# Altium schematic sheet Raspi_side.SchDoc
size A4; Organization: Altium Limited; Address1: L3, 12a Rodborough Rd; Address2: Frenchs Forest; Address3: NSW; Address4: Australia 2086; SheetNumber: 3; SheetTotal: 3
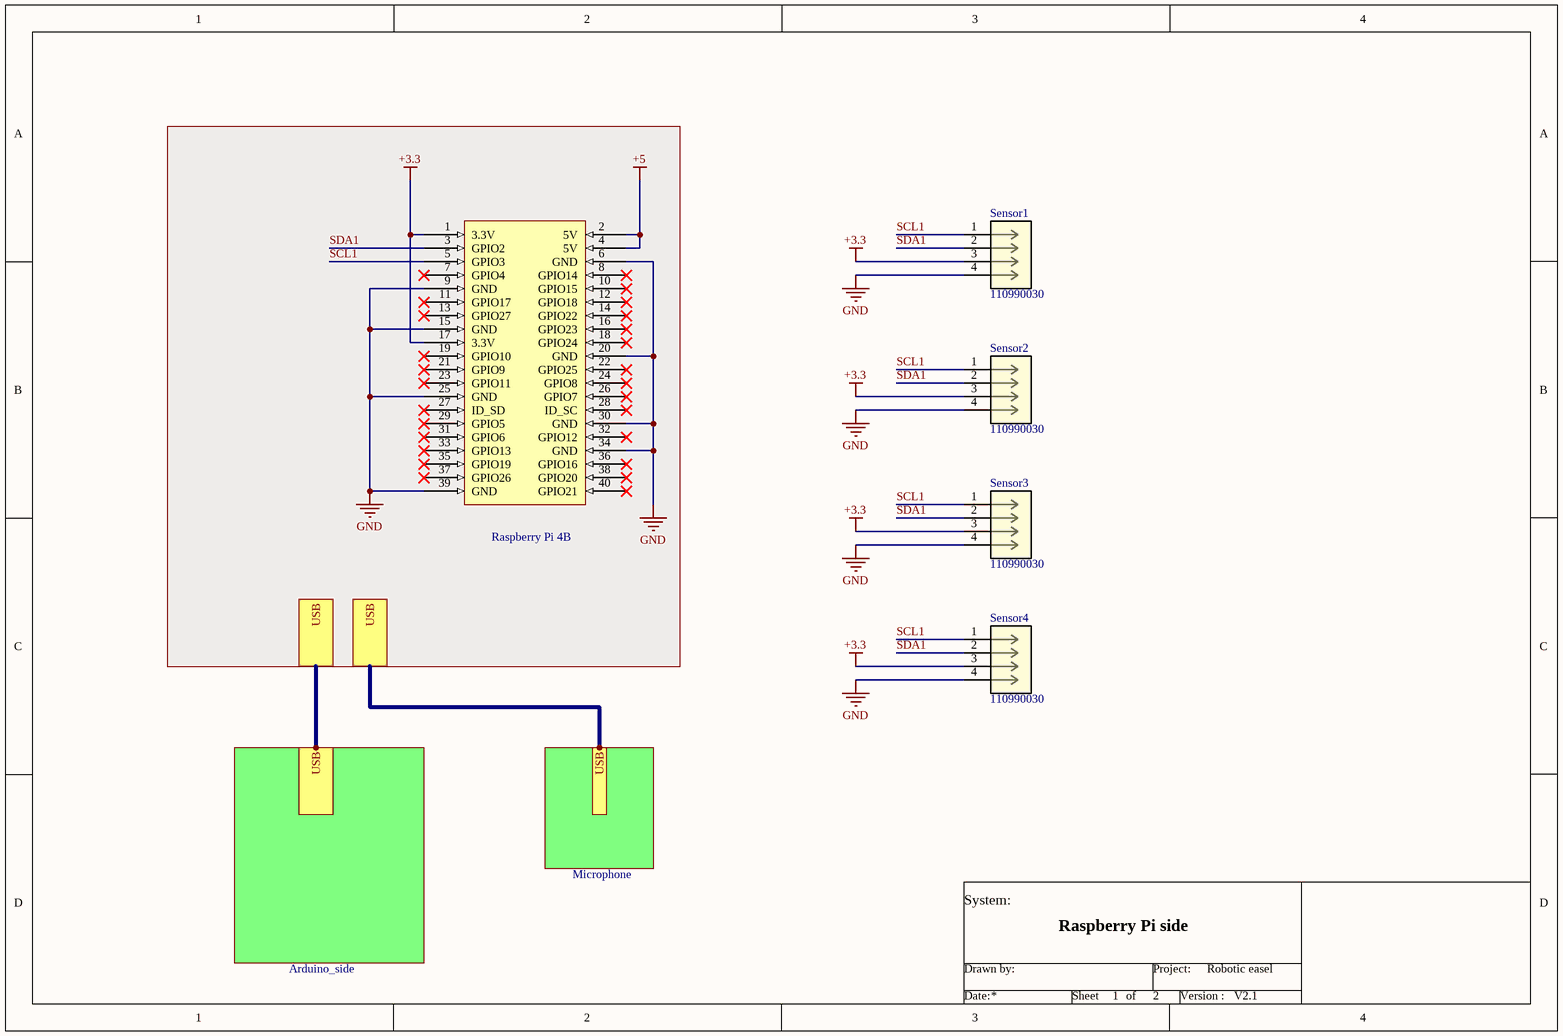
[diagram p0: Raspi_side.SchDoc]

## Parts
*?  Raspberry Pi 4B
Sensor1  110990030  [CONN_110990030_SEE]
Sensor2  110990030  [CONN_110990030_SEE]
Sensor3  110990030  [CONN_110990030_SEE]
Sensor4  110990030  [CONN_110990030_SEE]

## Sub-sheets
Arduino_side = Arduino_side.SchDoc: USB
Microphone = File Name: Port

## Ports
USB

## Nets
+3.3: *?.1(3.3V) *?.17(3.3V) Sensor1.3 Sensor2.3 Sensor3.3 Sensor4.3
+5: *?.2(5V) *?.4(5V)
GND: *?.6(GND) *?.9(GND) *?.15(GND) *?.20(GND) *?.25(GND) *?.30(GND) *?.34(GND) *?.39(GND) Sensor1.4 Sensor2.4 Sensor3.4 Sensor4.4
SCL1: *?.5(GPIO3) Sensor1.1 Sensor2.1 Sensor3.1 Sensor4.1
SDA1: *?.3(GPIO2) Sensor1.2 Sensor2.2 Sensor3.2 Sensor4.2
USB: port USB, sheet Arduino_side/USB, sheet Microphone/Port

Not connected (* = marked no-connect by the designer): *? 7(GPIO4)* 8(GPIO14)* 10(GPIO15)* 11(GPIO17)* 12(GPIO18)* 13(GPIO27)* 14(GPIO22)* 16(GPIO23)* 18(GPIO24)* 19(GPIO10)* 21(GPIO9)* 22(GPIO25)* 23(GPIO11)* 24(GPIO8)* 26(GPIO7)* 27(ID_SD)* 28(ID_SC)* 29(GPIO5)* 31(GPIO6)* 32(GPIO12)* 33(GPIO13)* 35(GPIO19)* 36(GPIO16)* 37(GPIO26)* 38(GPIO20)* 40(GPIO21)*

## Notes on the sheet
- Raspberry Pi side
- Robotic easel
- 1
- 2
- V2.1
- System:
- Drawn by:
- Project:
- Date:
- Sheet
- of
- Version :

## Library data of the parts
*? = RasPi_4: 40 pins header of RasPi4
Sensor1-Sensor4 = 110990030: No Description Available; Mfr_Name: Seeed Studio; Copyright: Copyright (C) 2022 Ultra Librarian. All rights reserved.; Manufacturer_Part_Number: 110990030; RefDes: RefDes; Type: DEV